# EAGLE design PDB - Copy (EAGLE 9.6.2)
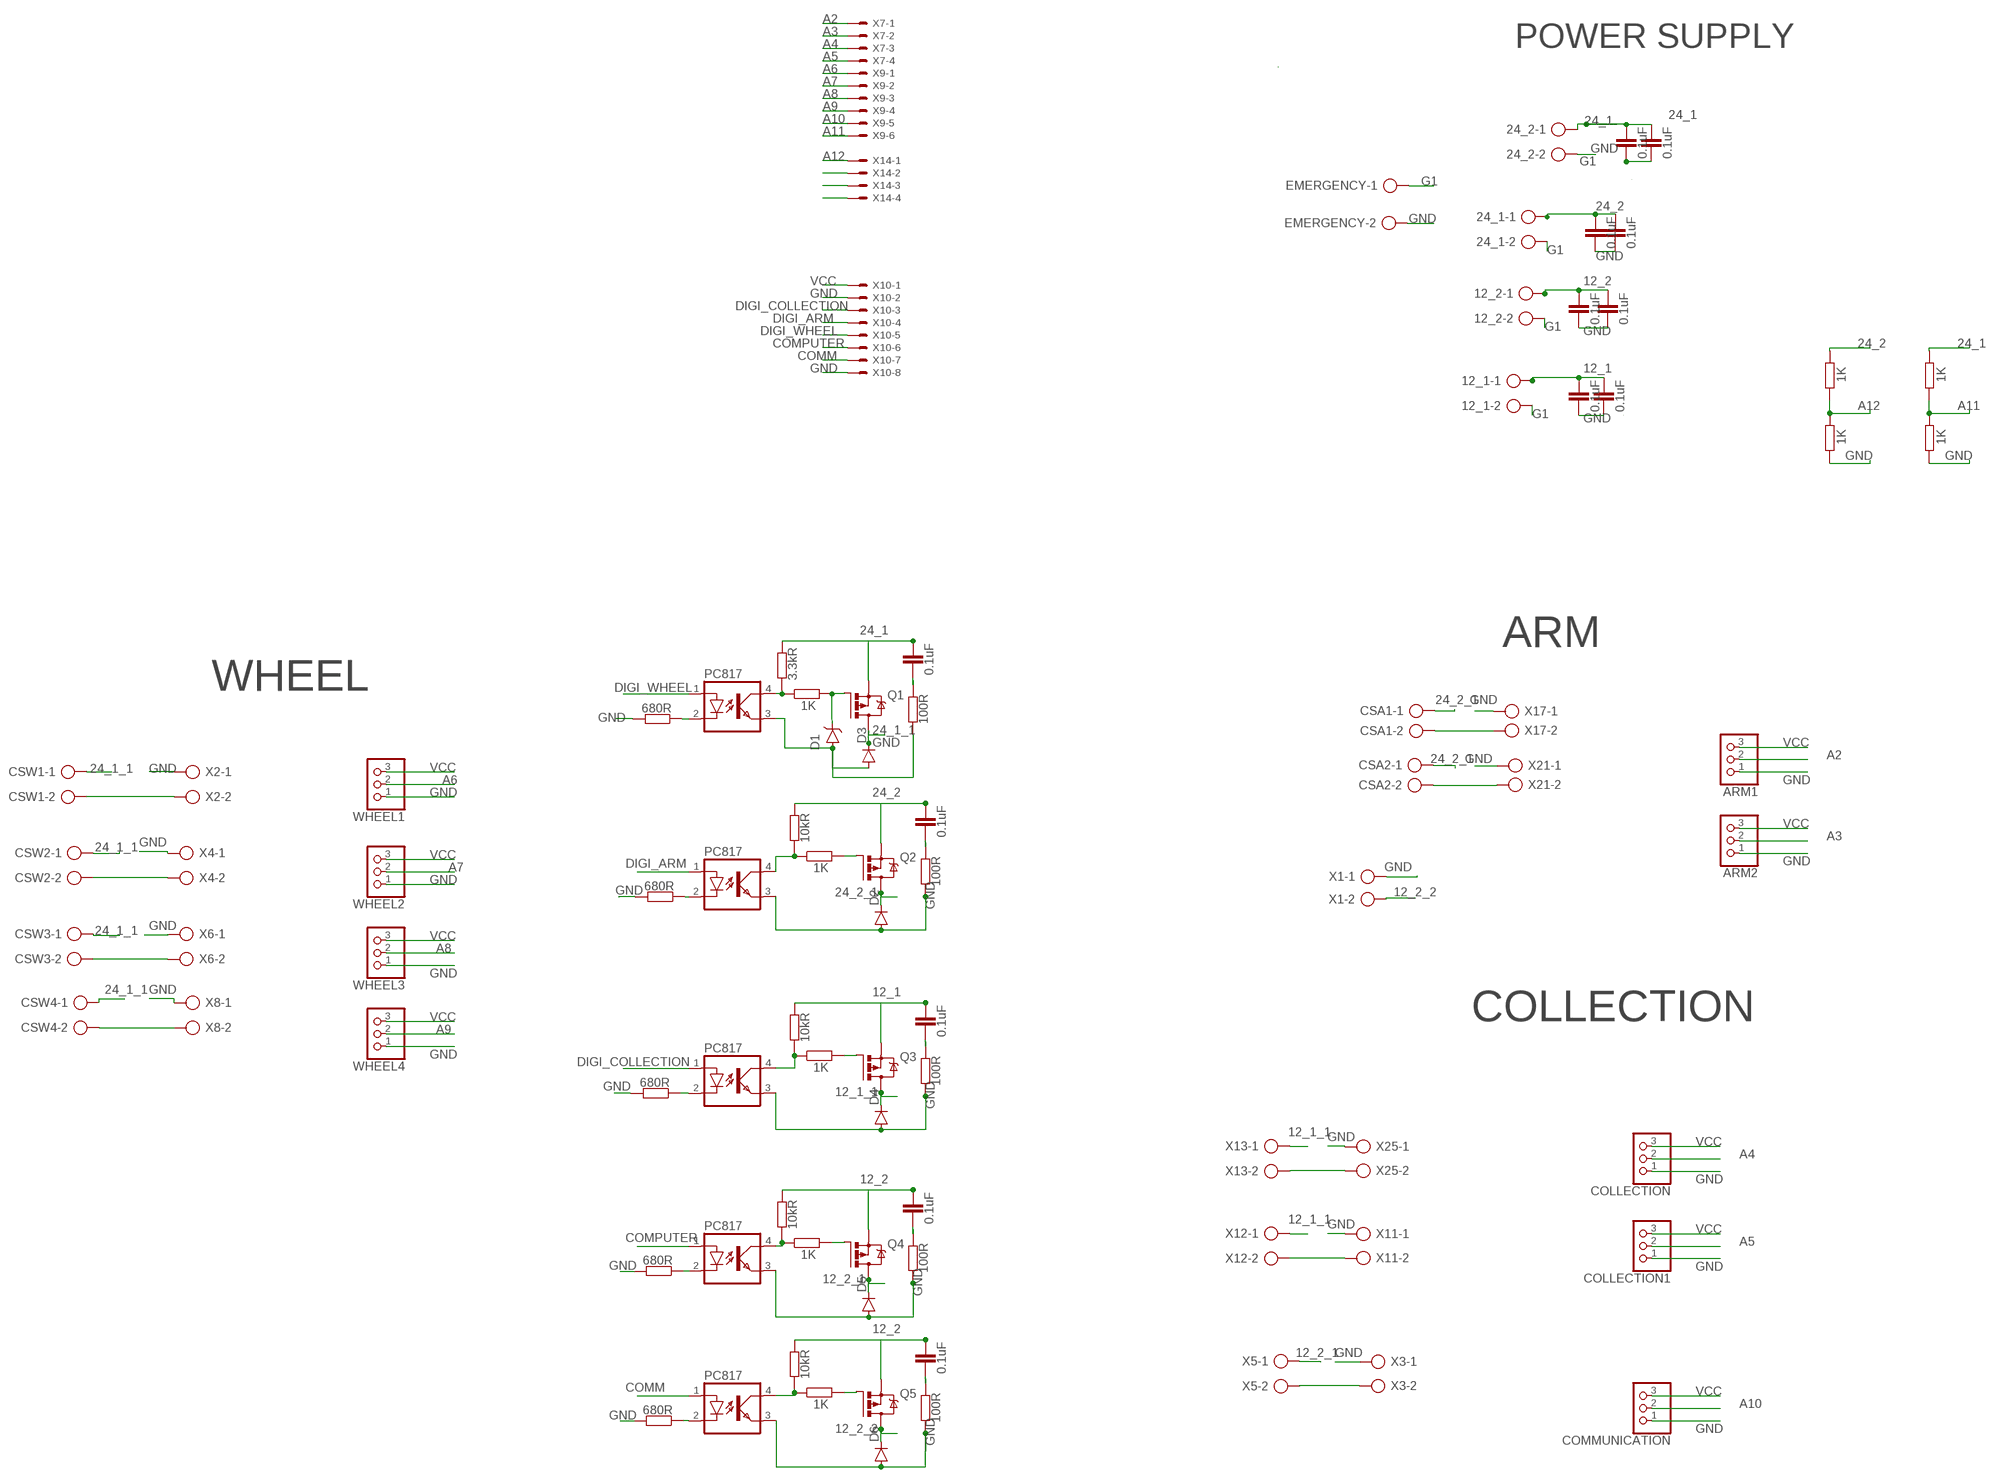
[diagram p0: schematic, sheet 1]

## Parts
12_1  AK300/2  [AK300/2]
12_2  AK300/2  [AK300/2]
24_1  AK300/2  [AK300/2]
24_2  AK300/2  [AK300/2]
ARM1  PINHD-1X3  [1X03]
ARM2  PINHD-1X3  [1X03]
C1  0.1uF  C-EUC1206  [C1206]
C2  0.1uF  C-EUC1206  [C1206]
C3  0.1uF  C-EUC1206  [C1206]
C4  0.1uF  C-EUC1206  [C1206]
C5  0.1uF  C-EUC1206  [C1206]
C6  0.1uF  C-EUC1206  [C1206]
C7  0.1uF  C-EUC1206  [C1206]
C8  0.1uF  C-EUC1206  [C1206]
C9  0.1uF  C-EUC1206  [C1206]
C10  0.1uF  C-EUC1206  [C1206]
C11  0.1uF  C-EUC1206  [C1206]
C18  0.1uF  C-EUC1206  [C1206]
C19  0.1uF  C-EUC1206  [C1206]
COLLECTION  PINHD-1X3  [1X03]
COLLECTION1  PINHD-1X3  [1X03]
COMMUNICATION  PINHD-1X3  [1X03]
CSA1  AK300/2  [AK300/2]
CSA2  AK300/2  [AK300/2]
CSW1  AK300/2  [AK300/2]
CSW2  AK300/2  [AK300/2]
CSW3  AK300/2  [AK300/2]
CSW4  AK300/2  [AK300/2]
D1  1N4740A-TR  [DO-41]
D2  1N4942  [DO41-10]
D3  1N4942  [DO41-10]
D4  1N4942  [DO41-10]
D5  1N4942  [DO41-10]
D6  1N4942  [DO41-10]
EMERGENCY  AK300/2  [AK300/2]
OK1  PC817  [DIL04]
OK2  PC817  [DIL04]
OK3  PC817  [DIL04]
OK4  PC817  [DIL04]
OK5  PC817  [DIL04]
Q1  PMOSFET-BACKUP_TO220  [TO220BV]
Q2  PMOSFET-BACKUP_TO220  [TO220BV]
Q3  PMOSFET-BACKUP_TO220  [TO220BV]
Q4  PMOSFET-BACKUP_TO220  [TO220BV]
Q5  PMOSFET-BACKUP_TO220  [TO220BV]
R1  680R  R-EU_R1206  [R1206]
R2  1K  R-EU_R1206  [R1206]
R3  3.3kR  R-EU_R1206  [R1206]
R4  100R  R-EU_R1206  [R1206]
R5  680R  R-EU_R1206  [R1206]
R6  100R  R-EU_R1206  [R1206]
R7  1K  R-EU_R1206  [R1206]
R8  10kR  R-EU_R1206  [R1206]
R9  680R  R-EU_R1206  [R1206]
R10  100R  R-EU_R1206  [R1206]
R11  1K  R-EU_R1206  [R1206]
R12  10kR  R-EU_R1206  [R1206]
R13  680R  R-EU_R1206  [R1206]
R14  100R  R-EU_R1206  [R1206]
R15  1K  R-EU_R1206  [R1206]
R16  10kR  R-EU_R1206  [R1206]
R17  1K  R-EU_R1206  [R1206]
R18  1K  R-EU_R1206  [R1206]
R19  1K  R-EU_R1206  [R1206]
R20  1K  R-EU_R1206  [R1206]
R21  100R  R-EU_R1206  [R1206]
R22  1K  R-EU_R1206  [R1206]
R23  10kR  R-EU_R1206  [R1206]
R24  680R  R-EU_R1206  [R1206]
WHEEL1  PINHD-1X3  [1X03]
WHEEL2  PINHD-1X3  [1X03]
WHEEL3  PINHD-1X3  [1X03]
WHEEL4  PINHD-1X3  [1X03]
X1  AK300/2  [AK300/2]
X2  AK300/2  [AK300/2]
X3  AK300/2  [AK300/2]
X4  AK300/2  [AK300/2]
X5  AK300/2  [AK300/2]
X6  AK300/2  [AK300/2]
X7  JST-XH-04-PIN-LONG-PAD  [JST-XH-04-PACKAGE-LONG-PAD]
X8  AK300/2  [AK300/2]
X9  JST-XH-06-PIN-LONG-PAD  [JST-XH-06-PACKAGE-LONG-PAD]
X10  JST-XH-08-PIN-LONG-PAD  [JST-XH-08-PACKAGE-LONG-PAD]
X11  AK300/2  [AK300/2]
X12  AK300/2  [AK300/2]
X13  AK300/2  [AK300/2]
X14  JST-XH-04-PIN-LONG-PAD  [JST-XH-04-PACKAGE-LONG-PAD]
X17  AK300/2  [AK300/2]
X21  AK300/2  [AK300/2]
X25  AK300/2  [AK300/2]

## Nets
12_1 [HV]: 12_1.1 C3.2 C9.2 C10.2 Q3.S R12.2
12_1_1 [HV]: D4.C Q3.D X12.1 X13.1
12_2 [HV]: 12_2.1 C4.2 C5.2 C6.2 C11.2 Q4.S Q5.S R16.2 R23.2
12_2_1 [HV]: D5.C Q4.D X5.1
12_2_2 [HV]: D6.C Q5.D X1.2
24_1 [HV]: 24_2.1 C1.2 C7.2 C8.2 Q1.S R3.2 R19.2
24_1_1 [HV]: CSW1.1 CSW2.1 CSW3.1 CSW4.1 D3.C Q1.D
24_2 [HV]: 24_1.1 C2.2 C18.2 C19.2 Q2.S R8.2 R17.2
24_2_1 [HV]: CSA1.1 CSA2.1 D2.C Q2.D
A2: ARM1.2 X7.1
A3: ARM2.2 X7.2
A4: COLLECTION.2 X7.3
A5: COLLECTION1.2 X7.4
A6: WHEEL1.2 X9.1
A7: WHEEL2.2 X9.2
A8: WHEEL3.2 X9.3
A9: WHEEL4.2 X9.4
A10: COMMUNICATION.2 X9.5
A11: R19.1 R20.2 X9.6
A12: R17.1 R18.2 X14.1
COMM: OK5.1(A) X10.7
COMPUTER: OK4.1(A) X10.6
DIGI_ARM: OK2.1(A) X10.4
DIGI_COLLECTION: OK3.1(A) X10.3
DIGI_WHEEL: OK1.1(A) X10.5
G1 [gnd]: 12_1.2 12_2.2 24_1.2 24_2.2 EMERGENCY.1
GND [gnd]: ARM1.1 ARM2.1 C5.1 C6.1 C7.1 C8.1 C9.1 C10.1 C18.1 C19.1 COLLECTION1.1 COLLECTION.1 COMMUNICATION.1 D1.A D2.A D3.A D4.A D5.A D6.A EMERGENCY.2 OK1.3(EMIT) OK2.3(EMIT) OK3.3(EMIT) OK4.3(EMIT) OK5.3(EMIT) R1.2 R4.1 R5.2 R6.1 R9.2 R10.1 R13.2 R14.1 R18.1 R20.1 R21.1 R24.2 WHEEL1.1 WHEEL2.1 WHEEL3.1 WHEEL4.1 X1.1 X2.1 X3.1 X4.1 X6.1 X8.1 X10.2 X10.8 X11.1 X17.1 X21.1 X25.1
N$1: OK1.4(COL) R2.1 R3.1
N$2: OK4.2(C) R13.1
N$3: OK3.2(C) R9.1
N$4: OK2.4(COL) R7.1 R8.1
N$5: C2.1 R6.2
N$6: OK3.4(COL) R11.1 R12.1
N$7: C4.1 R14.2
N$8: C3.1 R10.2
N$9: Q4.G R15.2
N$10: OK4.4(COL) R15.1 R16.1
N$11: C11.1 R21.2
N$12: OK5.4(COL) R22.1 R23.1
N$13: Q5.G R22.2
N$14: OK2.2(C) R5.1
N$15: OK1.2(C) R1.1
N$18: X11.2 X12.2
N$19: Q2.G R7.2
N$20: X14.2
N$21: OK5.2(C) R24.1
N$22: Q3.G R11.2
N$23: X14.3
N$24: X14.4
N$29: CSW1.2 X2.2
N$32: CSW2.2 X4.2
N$33: C1.1 R4.2
N$35: D1.C Q1.G R2.2
N$36: CSW3.2 X6.2
N$40: CSW4.2 X8.2
N$51: CSA1.2 X17.2
N$53: CSA2.2 X21.2
N$57: X13.2 X25.2
N$67: X3.2 X5.2
VCC [vcc]: ARM1.3 ARM2.3 COLLECTION1.3 COLLECTION.3 COMMUNICATION.3 WHEEL1.3 WHEEL2.3 WHEEL3.3 WHEEL4.3 X10.1

## Notes on the sheet
- POWER SUPPLY
- ARM
- WHEEL
- COLLECTION

## Library data of the parts
12_1 12_2 24_1 24_2 CSA1 CSA2 CSW1-CSW4 EMERGENCY X1-X6 X8 X11-X13 X17 X21 X25 = con-ptr500:AK300/2: CONNECTOR; OC_FARNELL: unknown; OC_NEWARK: unknown
ARM1 ARM2 COLLECTION COLLECTION1 COMMUNICATION WHEEL1-WHEEL4 = adafruit:PINHD-1X3: PIN HEADER
C1-C11 C18 C19 = rcl:C-EU: CAPACITOR, European symbol; SPICEPREFIX: C
D1 = Diodes-2:1N4740A-TR: DIODE ZENER 10V 1.3W DO41 Manufacturer's datasheet <https://www.vishay.com/docs/85816/1n4728a.pdf>; CREATED_BY: PCBLayout.com; DIGIKEY_PART_NUMBER: 1N4740AVSCT-ND; MANUFACTURER: Vishay General Semiconductor - Diodes Division; MPN: 1N4740A-TR; PACKAGE: DO-41
D2-D6 = diode:1N4942: DIODE 1.0 A, 200 V, 150 ns
OK1-OK5 = optocoupler:PC817: SHARP OPTO COUPLER; MPN: PC817X4J000F; OC_FARNELL: 9707727; OC_NEWARK: 97K7059
Q1-Q5 = Tinkercad:PMOSFET-BACKUP: P-Channel MOSFET - Generic
R1-R24 = rcl:R-EU_: RESISTOR, European symbol; SPICEPREFIX: R
X7 X14 = JST:JST-XH-04-PIN: JST XH Connector 2 Pin Wire to board connector. Pitch: 2,54 mm, (0.100") Number of pins: 4 Created by Rembrandt Electronics www.rembrandtelectronics.com
X9 = JST:JST-XH-06-PIN: JST XH Connector 2 Pin Wire to board connector. Pitch: 2,54 mm, (0.100") Number of pins: 6 Created by Rembrandt Electronics www.rembrandtelectronics.com
X10 = JST:JST-XH-08-PIN: JST XH Connector 2 Pin Wire to board connector. Pitch: 2,54 mm, (0.100") Number of pins: 8 Created by Rembrandt Electronics www.rembrandtelectronics.com

## Net classes
0 default: width 0.8 mm, drill 0.889 mm, clearance 0.381 mm
1 HV: width 2 mm, drill 0.889 mm, clearance 0.381 mm
2 gnd: width 1 mm, drill 0.889 mm, clearance 0.381 mm
3 vcc: width 0.7 mm, drill 0.889 mm, clearance 0.381 mm

## Board
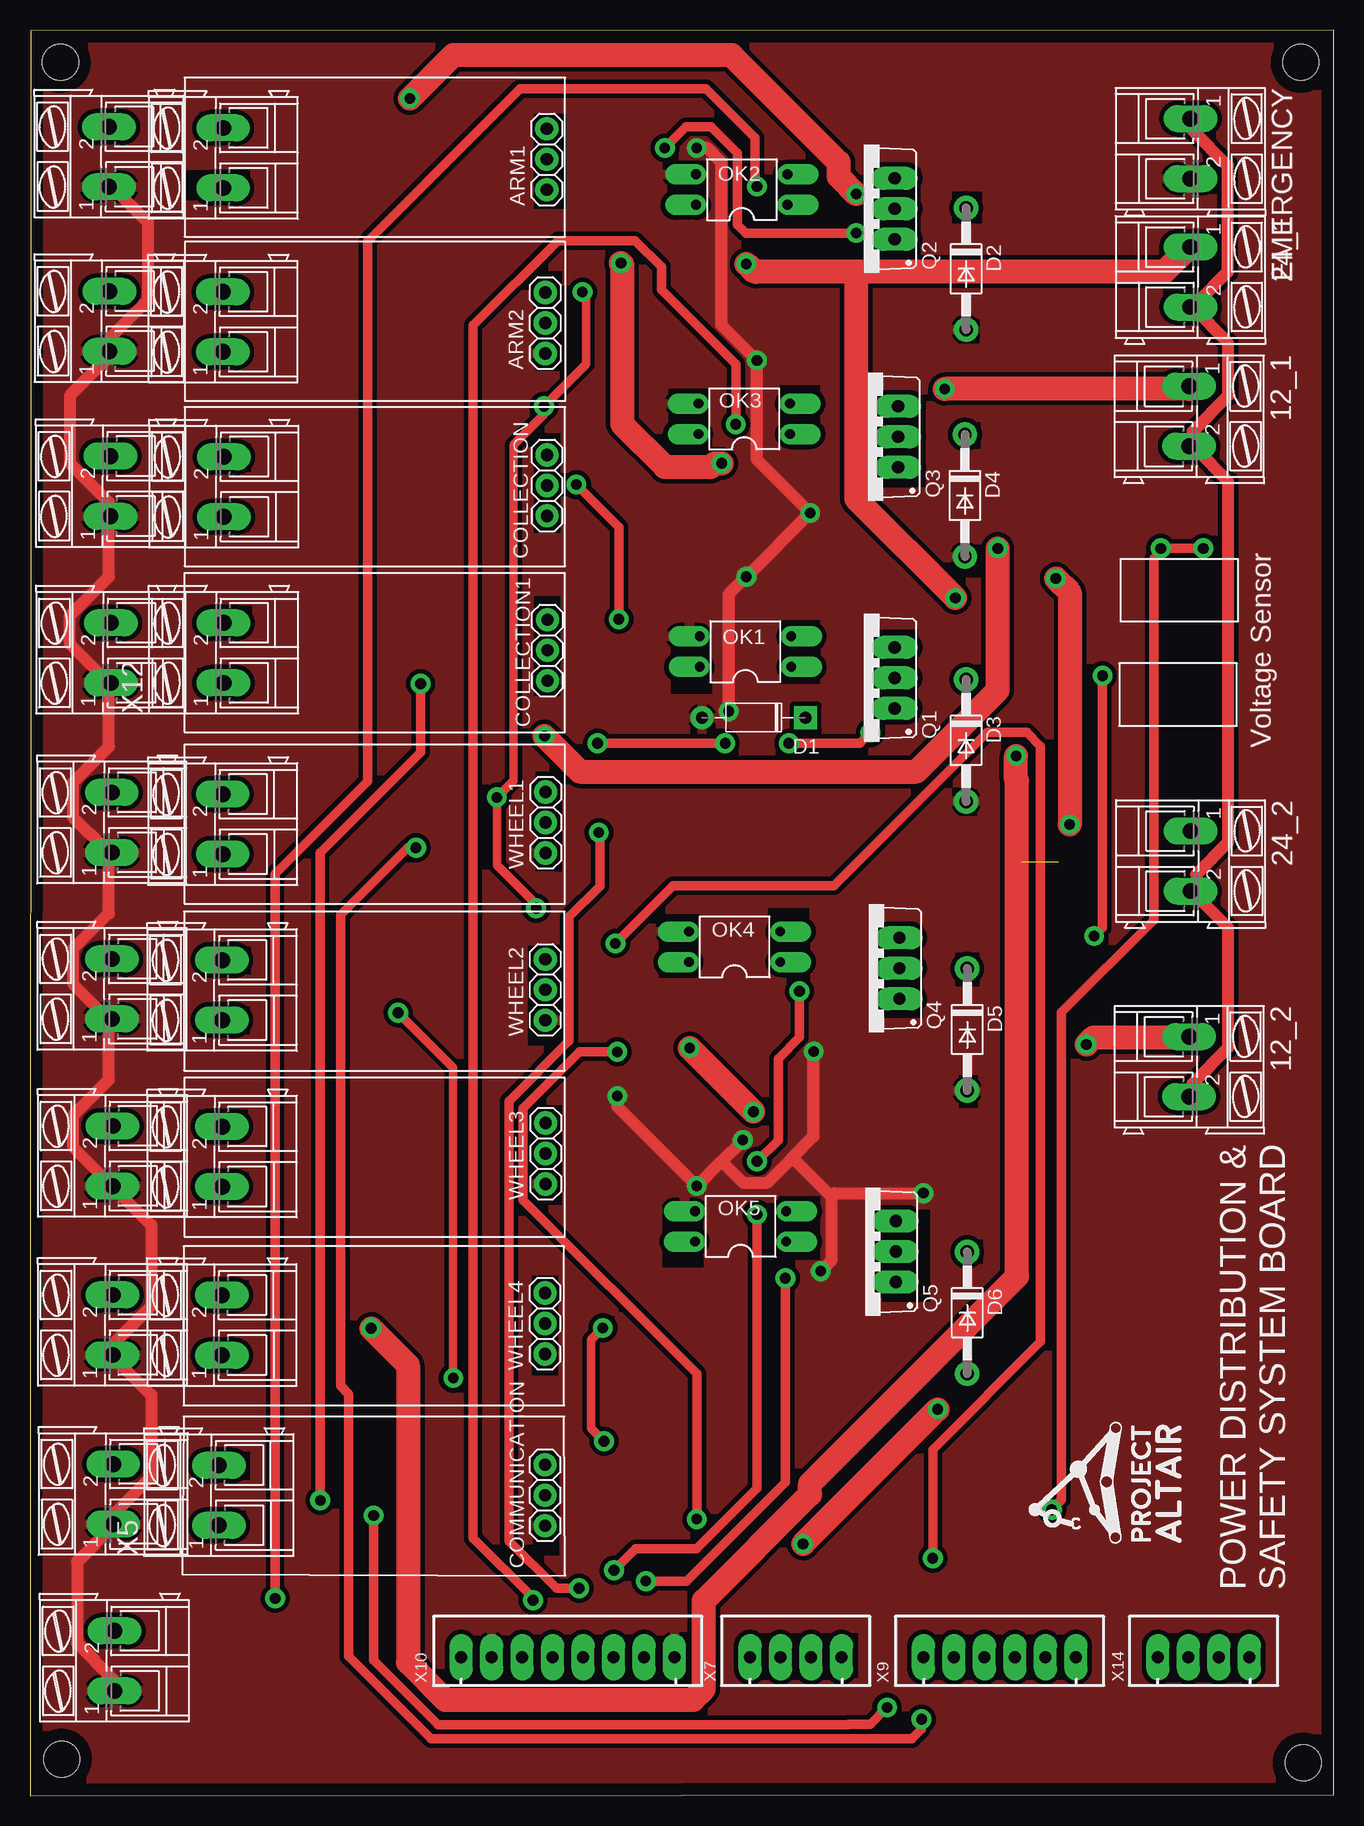
[diagram p1: board, top side]
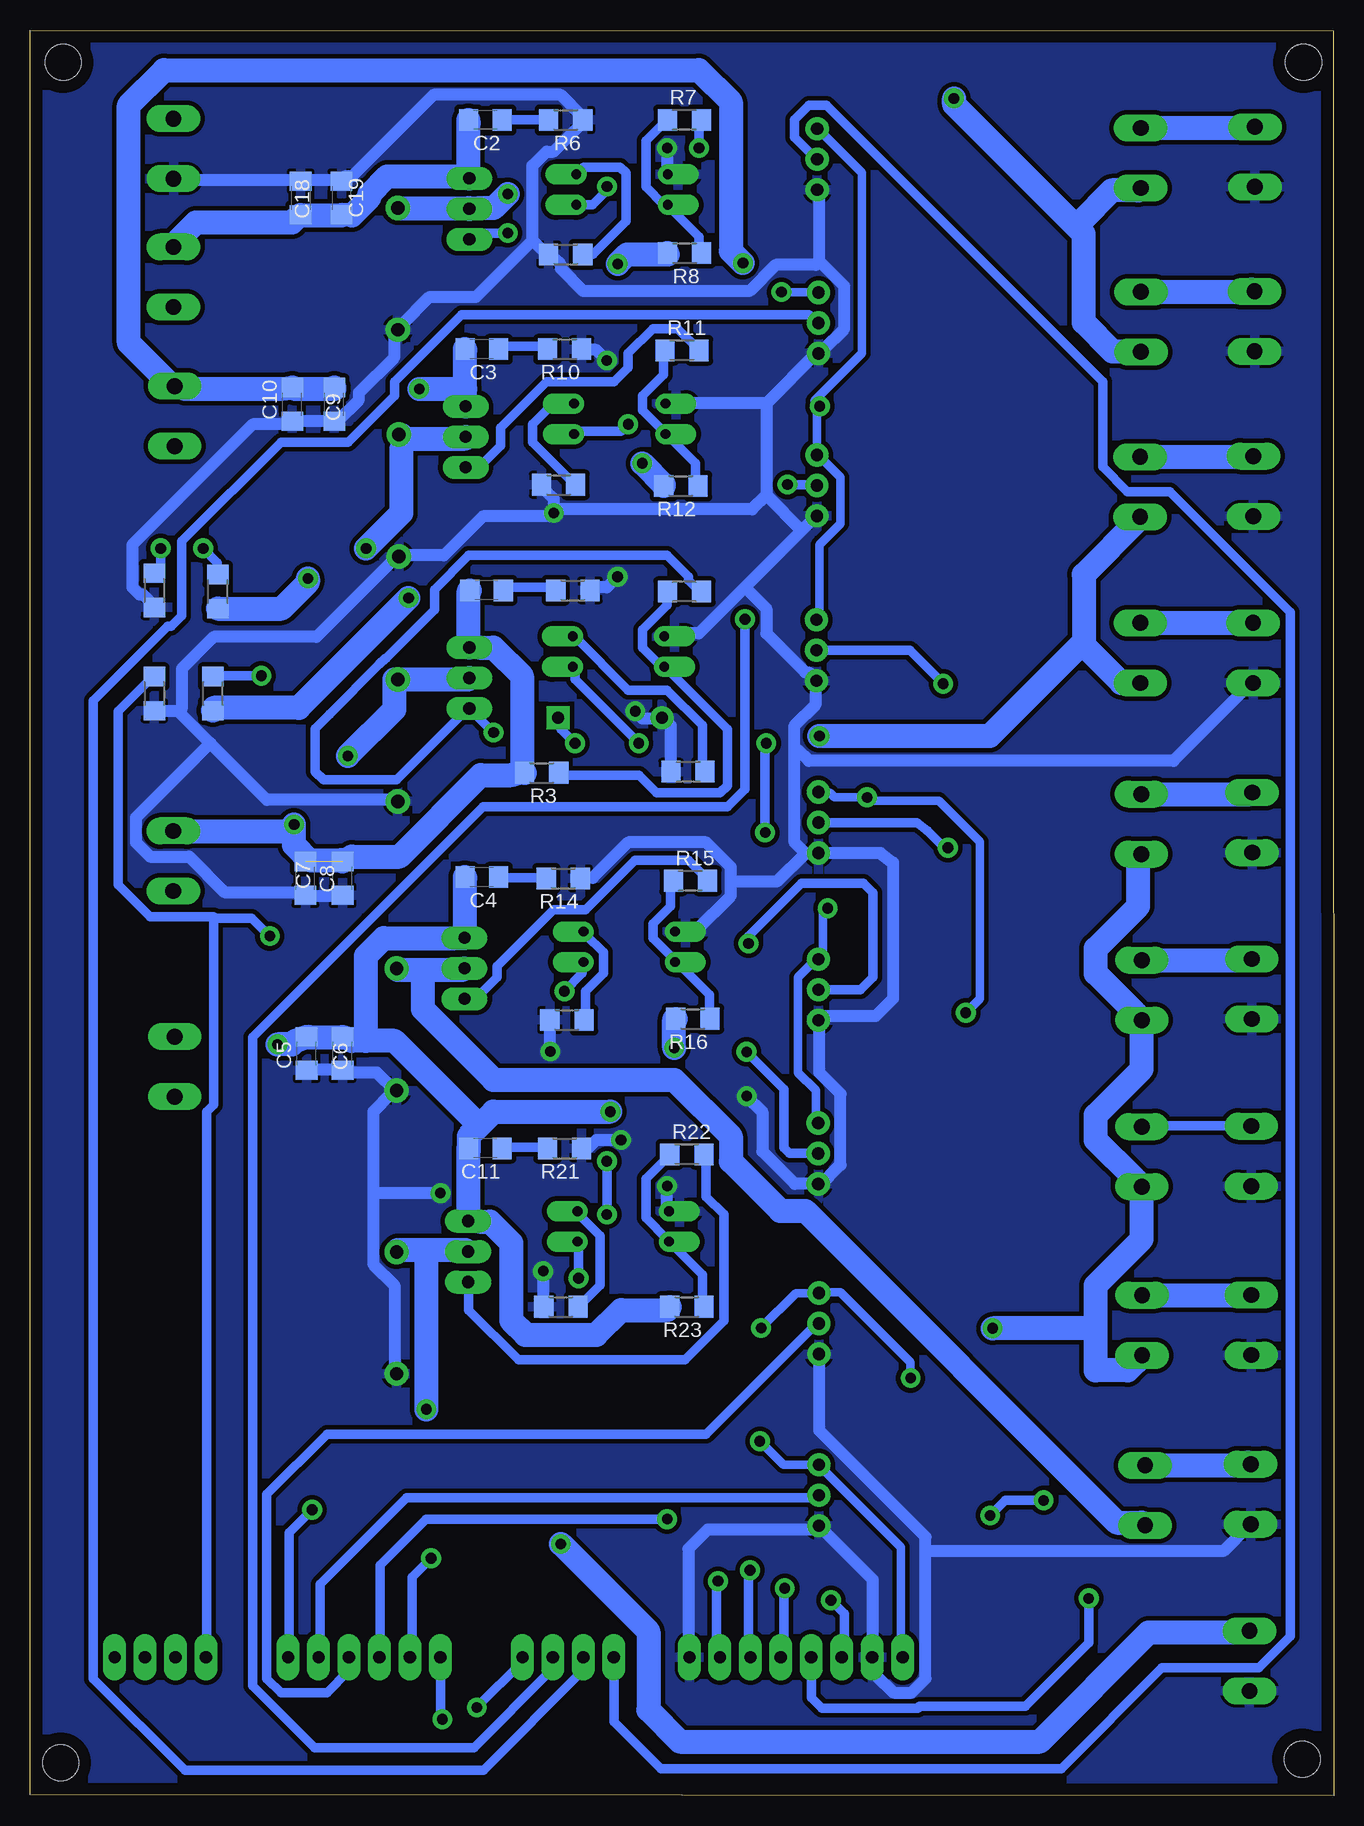
[diagram p2: board, bottom side, seen from below]

Size 108.7 x 147.14 mm. Coordinates in mm from the lower left corner, seen from the top.
Outline: 0,0 108.7,0.07 108.67,147.14 0.07,147.07 0,0
Copper layers (1*16): Top 0.035mm / dielectric 1.5mm / Bottom 0.035mm
Design rules "default *": minimum track width 0.7mm, minimum drill 0.65mm, track to track 15mil, track to pad 15mil, pad to pad 6mil, via to via 15mil, smd to smd 6mil, copper to edge 40mil, drill to drill 6mil, minimum pad ring 18mil, minimum via ring 15mil, stop-mask expansion 4mil, vias tented up to drill 0mil, thermal gap 10mil
Holes 3 mm at 2.54,144.45 105.94,144.45 106.14,2.75 2.64,3.05
tRestrict: area 42,132.2 to 44.7,140.1; area 53.3,131.5 to 56.5,136.2; area 70.4,128.2 to 74.2,135.6; area 62.4,131.6 to 65.7,136.2; area 76.8,131 to 79.3,133.6; area 77.3,121 to 79.1,123; area 77.1,112.2 to 79.2,114.4; area 76.9,101.5 to 79.4,104.1; area 70.6,109 to 74.6,116.7; area 62.5,112.5 to 65.8,117.5; area 53.2,111.9 to 56.6,117.2; area 42.1,118.7 to 44.3,127; 46 more areas

### Footprints (pad centres in the part's own frame; a part is rotated, then mirrored left to right if it is on the bottom)
AK300/2 = drill 1.321 long: 1 -2.515,0; 2 2.489,0
1X03 = drill 1.016: 1 -2.54,0; 2 0,0; 3 2.54,0
C1206 = smd 1.6 x 1.8: 1 -1.4,0; 2 1.4,0
DO-41 = drill 1: A 4.325,0 | drill 1 square: C -4.325,0
DO41-10 = drill 1.118: A 5.08,0; C -5.08,0
DIL04 = drill 0.813 offset: 1 -1.27,-3.81; 2 1.27,-3.81; 3 1.27,3.81; 4 -1.27,3.81
TO220BV = drill 1.016 long: D 0,-2.54; G -2.54,-2.54; S 2.54,-2.54
R1206 = smd 1.6 x 1.803: 1 -1.422,0; 2 1.422,0
JST-XH-04-PACKAGE-LONG-PAD = drill 1.016 long: 1 -3.81,0; 2 -1.27,0; 3 1.27,0; 4 3.81,0
JST-XH-06-PACKAGE-LONG-PAD = drill 1.016 long: 1 -6.35,0; 2 -3.81,0; 3 -1.27,0; 4 1.27,0; 5 3.81,0; 6 6.35,0
JST-XH-08-PACKAGE-LONG-PAD = drill 1.016 long: 1 -8.89,0; 2 -6.35,0; 3 -3.81,0; 4 -1.27,0; 5 1.27,0; 6 3.81,0; 7 6.35,0; 8 8.89,0

### Placement (x,y rotation side)
12_1  96.64,114.95 270 top
12_2  96.64,60.75 270 top
24_1  96.74,126.55 270 top
24_2  96.75,77.88 270 top
ARM1  43.08,136.37 90 top
ARM2  42.96,122.73 90 top
C1  70.64,100.45 180 bottom
C2  70.74,139.65 180 bottom
C3  71.04,120.55 180 bottom
C4  71.04,76.55 180 bottom
C5  85.64,61.85 90 bottom
C6  82.64,61.85 90 bottom
C7  85.74,76.45 90 bottom
C8  82.64,76.45 90 bottom
C9  83.34,115.95 90 bottom
C10  86.84,115.95 90 bottom
C11  70.74,53.95 180 bottom
C18  86.14,133.15 270 bottom
C19  82.74,133.15 270 bottom
COLLECTION  43.1,109.19 90 top
COLLECTION1  43.14,95.45 90 top
COMMUNICATION  42.94,25.05 90 top
CSA1  16.11,136.49 90 top
CSA2  16.08,122.83 90 top
CSW1  16.06,80.97 90 top
CSW2  16.01,67.14 90 top
CSW3  16.01,53.27 90 top
CSW4  15.99,39.22 90 top
D1  60.34,89.85 180 top
D2  78.04,127.25 270 top
D3  78.04,87.95 270 top
D4  77.94,108.35 270 top
D5  78.14,63.85 270 top
D6  78.14,40.25 270 top
EMERGENCY  96.74,137.25 270 top
OK1  59.64,95.35 90 top
OK2  59.34,133.85 90 top
OK3  59.54,114.75 90 top
OK4  58.74,70.75 90 top
OK5  59.24,47.45 90 top
Q1  69.54,93.15 90 top
Q2  69.54,132.25 90 top
Q3  69.84,113.25 90 top
Q4  69.94,68.95 90 top
Q5  69.64,45.35 90 top
R1  53.84,85.35 180 bottom
R2  54.14,100.35 0 bottom
R3  66.04,85.25 180 bottom
R4  63.44,100.45 180 bottom
R5  64.04,128.45 180 bottom
R6  64.04,139.65 180 bottom
R7  54.14,139.65 0 bottom
R8  54.14,128.55 180 bottom
R9  64.64,109.25 180 bottom
R10  64.14,120.55 180 bottom
R11  54.34,120.45 0 bottom
R12  54.44,109.15 180 bottom
R13  63.94,64.65 180 bottom
R14  64.24,76.45 180 bottom
R15  53.64,76.25 0 bottom
R16  53.44,64.75 180 bottom
R17  93.44,91.85 270 bottom
R18  98.34,91.85 90 bottom
R19  93.04,100.35 270 bottom
R20  98.34,100.45 90 bottom
R21  64.14,53.95 180 bottom
R22  53.94,53.45 0 bottom
R23  53.94,40.75 180 bottom
R24  64.44,40.75 180 bottom
U$2  [ALTAIR]  96.94,20.15 90 top
WHEEL1  42.98,81.1 90 top
WHEEL2  42.96,67.17 90 top
WHEEL3  42.99,53.52 90 top
WHEEL4  42.94,39.35 90 top
X1  7.04,11.25 90 top
X2  6.82,81.11 90 top
X3  6.94,25.15 90 top
X4  6.84,67.24 90 top
X5  15.74,25.05 90 top
X6  6.89,53.32 90 top
X7  63.84,11.55 0 top
X8  6.89,39.24 90 top
X9  80.84,11.55 0 top
X10  44.84,11.55 0 top
X11  6.74,95.25 90 top
X12  16.14,95.25 90 top
X13  16.15,109.09 90 top
X14  97.84,11.55 0 top
X17  6.58,136.59 90 top
X21  6.61,122.88 90 top
X25  6.71,109.14 90 top

### Tracks (layer width: path | path; a pad name or v marks a point on that pad's centre or on a via)
12_1  (via drill 0.89)
  Top 2: v57.65,111.03 57.06,111.03 56.77,110.74 52.93,110.74 49.37,114.3 49.37,127.62 v49.27,127.72 | v76.25,117.23 96.63,117.23 12_1.1
  Bottom 2: 72.42,117.23 72.42,116.05 Q3.S | 72.42,117.23 72.42,120.48 C3.2 | C9.2 83.34,117.23 86.59,117.23 C10.2 87.77,117.23 95.74,117.23 12_1.1 96.92,117.53 100.46,121.07 100.46,140.85 97.51,143.81 52.93,143.81 50.27,141.15 50.27,128.72 v49.27,127.72 | v57.65,111.03 55.88,109.26 R12.2 | v76.25,117.23 72.42,117.23
12_1_1  (via drill 0.89)
  Top 2: v80.68,103.95 80.68,92.14 73.89,85.35 45.84,85.35 v42.89,88.3
  Bottom 2: 77.44,113.1 72.42,113.1 Q3.D | 77.44,113.1 77.73,113.4 D4.C | X12.1 17.73,92.73 20.86,95.87 20.86,96.16 | 20.86,96.16 20.86,101.77 16.32,106.31 X13.1 | v80.68,103.95 77.73,106.9 77.73,112.22 77.44,113.1 | v42.89,88.3 28.72,88.3 20.86,96.16
12_2  (via drill 0.89)
  Top 2: v60.31,57 v55,62.32 | v88.06,62.61 88.65,63.2 96.63,63.2 12_2.1
  Bottom 2: C4.2 72.42,76.49 72.42,71.77 Q4.S 73.3,71.47 79.21,71.47 80.68,69.99 80.68,62.91 | R23.2 55.59,40.47 59.43,40.47 61.49,38.4 67.4,38.4 68.58,39.58 68.58,46.08 70.35,47.85 71.24,47.85 Q5.S 72.12,48.15 72.12,53.76 C11.2 72.12,54.94 71.24,55.82 | v55,62.32 55,64.68 R16.2 | v60.31,57 70.05,57 71.24,55.82 | 80.68,62.91 78.32,62.91 71.24,55.82 | 80.68,62.91 81.86,62.91 C6.2 82.75,63.2 85.41,63.2 C5.2 86.59,62.91 86.88,62.61 v88.06,62.61
12_2_1
  Bottom 2: 75.96,68.81 78.03,68.81 D5.C | 75.96,68.81 72.71,68.81 Q4.D | 75.96,68.81 75.96,65.57 70.05,59.66 55,59.66 50.27,54.94 50.27,52.87 46.14,48.74 44.07,48.74 18.09,22.75 16.02,22.75 X5.1
12_2_2  (via drill 0.89)
  Top 2: v75.66,32.2 v64.44,20.98
  Bottom 2: 75.66,45.49 78.03,45.49 D6.C | 75.66,45.49 72.42,45.49 Q5.D | v64.44,20.98 57.15,13.69 57.15,7.14 54.52,4.52 24.53,4.52 15.44,13.6 7.17,13.6 X1.2 | 75.66,45.49 v75.66,32.2
24_1  (via drill 0.89)  (1 unrouted)
  Top 2: v85.52,101.43 86.68,100.28 v86.68,80.93
  Bottom 2: C1.2 72.12,100.41 72.12,95.98 Q1.S 71.24,95.68 70.05,95.68 67.69,93.32 67.69,85.35 | 67.69,85.35 R3.2 | R19.2 87.74,98.92 85.52,101.14 v85.52,101.43 | 24_2.1 96.63,80.33 87.28,80.33 v86.68,80.93 86.68,79.23 85.41,77.97 82.75,77.97 C8.2 81.86,78.26 77.91,78.26 71.12,85.05 68.58,85.05 67.69,85.35
24_1_1  (via drill 0.89)
  Top 2: v82.2,86.65 82.2,84.65 82.28,84.57 82.28,43.25 65.03,26 65.03,25.12 56.18,16.26 56.18,8.88 55.29,7.99 34.62,7.99 31.51,11.1 31.51,35.88 v28.44,38.95
  Bottom 2: v82.2,86.65 78.32,90.53 78.32,93.02 D3.C 72.2,93.03 Q1.D | 19.86,38.95 v28.44,38.95 | CSW4.1 16.02,36.63 17.2,35.45 19.86,35.45 19.86,38.95 | 19.86,38.95 19.86,42.54 16.02,46.37 16.02,50.51 CSW3.1 16.61,51.39 19.86,54.64 19.86,56.71 16.02,60.55 16.02,64.38 CSW2.1 16.61,65.27 19.86,68.52 19.86,70.59 16.32,74.13 16.32,78.26 CSW1.1
24_2  (via drill 0.89)
  Top 2: v59.71,127.65 60.31,127.05 60.48,127.05 60.55,126.98 68.87,126.98 | 68.87,126.98 94.56,126.98 96.63,129.04 24_1.1 | v77.14,99.81 68.87,108.08 68.87,126.98
  Bottom 2: C2.2 72.12,139.38 72.12,134.95 Q2.S 73.01,134.95 78.91,134.95 80.39,133.47 80.39,133.18 81.86,131.7 C19.2 82.75,131.7 86,131.7 C18.2 86.88,131.11 94.86,131.11 96.63,129.34 24_1.1 | v59.71,127.65 58.91,128.45 55.52,128.45 55.56,128.47 R8.2 | v77.14,99.81 86.29,90.66 93.38,90.66 R17.2
24_2_1  (via drill 0.89)
  Top 2: v68.87,133.47 67.4,134.95 67.4,136.13 58.48,145.04 35.27,145.04 v31.67,141.44
  Bottom 2: D2.C 78.03,132.29 72.12,132.29 Q2.D 71.24,132.29 70.05,132.29 v68.87,133.47 | CSA1.1 16.32,133.77 18.52,133.77 21.19,131.1 21.19,130.46 | v31.67,141.44 31.67,140.94 21.19,130.46 | CSA2.1 16.11,120.35 18.44,120.35 20.86,122.77 20.86,130.13 21.19,130.46
A2
  Bottom 0.8: ARM1.2 43.19,136.43 44.96,138.2 44.96,139.67 43.78,140.85 42.3,140.85 19.27,117.82 19.27,110.74 17.2,108.67 13.66,108.67 3.62,98.63 3.62,13.31 6.28,10.65 14.34,10.65 22.74,2.25 56.12,2.25 60.02,6.15 60.02,11.53 X7.1
A3
  Bottom 0.8: X7.2 62.67,11.53 62.67,10.35 70.91,2.12 95.77,2.12 103.42,9.76 103.42,91.25 97.22,97.45 96.92,97.45 96.04,98.34 96.04,104.54 87.77,112.81 82.16,112.81 78.32,116.64 78.32,117.82 72.71,123.43 43.78,123.43 43.19,122.84 ARM2.2
A4  (via drill 0.89)
  Top 0.8: v49.09,98.04 49.09,105.72 v45.55,109.26
  Bottom 0.8: v49.09,98.04 49.09,83.87 50.57,82.4 70.94,82.4 90.13,63.2 90.13,9.17 84.96,4 71.68,4 65.33,10.35 65.33,11.53 X7.3 | v45.55,109.26 43.19,109.26 COLLECTION.2
A5  (via drill 0.89)
  Top 0.8: v71.45,7.35 70.05,5.95 68.25,5.95 68.22,5.93 34.03,5.93 28.65,11.31 v28.65,23.35 | v24.19,24.61 24.19,78.59 32.57,86.96 v32.57,92.66
  Bottom 0.8: v71.45,7.35 67.65,11.16 X7.4 | v24.19,24.61 27.39,24.61 v28.65,23.35 | v32.57,92.66 35.35,95.45 COLLECTION1.2
A6  (via drill 0.89)
  Top 0.8: v74.32,6.37 74.32,5.56 73.51,4.74 33.44,4.74 26.57,11.62 26.57,33.47 25.88,34.16 25.88,73.4 31.48,79 v32.18,79
  Bottom 0.8: X9.1 74.49,6.54 v74.32,6.37 | v32.18,79 32.48,79 33.89,80.42 34.78,81.1 WHEEL1.2
A7  (via drill 0.89)
  Top 0.8: v75.26,19.79 75.26,28.85 84.25,37.84 84.25,87.46 83.09,88.62 79.82,88.62 67.03,75.82 53.6,75.82 v48.8,71.02
  Bottom 0.8: v75.26,19.79 76.84,18.21 76.84,11.83 X9.2 | v48.8,71.02 48.8,71.62 44.4,76.02 39.2,76.02 38.43,75.25 38.43,68.2 39.47,67.17 WHEEL2.2
A8  (via drill 0.89)
  Top 0.8: v55.59,23.05 55.59,35.16 41.12,49.62 41.12,57.3 45.81,61.98 v48.96,61.98
  Bottom 0.8: v55.59,23.05 75.66,23.05 79.5,19.21 79.5,11.83 X9.3 | v48.96,61.98 45.86,58.88 45.86,53.99 45.39,53.52 WHEEL3.2
A9
  Bottom 0.8: X9.4 82.16,11.53 82.16,10.35 83.93,8.58 87.77,8.58 88.95,9.76 88.95,25.12 83.93,30.14 52.34,30.14 43.19,39.29 WHEEL4.2
A10
  Bottom 0.8: COMMUNICATION.2 43.19,24.82 77.32,24.82 84.52,17.62 84.52,11.83 X9.5
A11  (via drill 0.89)
  Top 0.8: v97.81,103.95 v94.26,103.95 94.26,103.65 93.67,103.06 93.67,72.95 86,65.27 86,24.64 v85.18,23.83
  Bottom 0.8: v94.26,103.95 93.08,102.77 93.08,101.88 R19.1 | v97.81,103.95 97.81,102.18 98.1,101.88 R20.2 | v85.18,23.83 87.08,21.93 87.08,11.66 X9.6
A12  (via drill 0.89)
  Top 0.8: v89.41,93.32 89.41,72.35 v88.7,71.64
  Bottom 0.8: R17.1 93.38,93.32 v89.41,93.32 | 93.38,73.14 90.2,73.14 v88.7,71.64 | R18.2 98.4,93.32 101.35,90.37 101.35,75.9 98.69,73.24 93.38,73.24 93.38,73.14 | 93.38,73.14 93.38,57.59 93.97,57 93.97,11.83 X14.1
COMM  (via drill 0.89)
  Top 0.8: v62.97,43.13 62.97,26.11 54.74,17.88 v51.34,17.88
  Bottom 0.8: v62.97,43.13 62.97,46.08 OK5.1 | v51.34,17.88 51.45,17.77 51.45,11.83 X10.7
COMPUTER  (via drill 0.89)
  Top 0.8: v64.15,67.04 64.15,63.2 62.38,61.43 62.38,54.64 v60.61,52.87 | v60.61,48.44 60.61,25.61 55.58,20.58 50.48,20.58 v48.68,18.78
  Bottom 0.8: v64.15,67.04 62.67,68.52 62.67,69.4 OK4.1 | v60.61,48.44 v60.61,52.87 | v48.68,18.78 48.8,18.67 48.8,11.83 X10.6
DIGI_ARM  (via drill 0.89)
  Top 0.8: v60.6,134.11 60.44,134.27 60.44,138.16 56.36,142.25 40.84,142.25 28.14,129.55 28.14,84.55 20.44,76.85 v20.44,16.45
  Bottom 0.8: OK2.1 61.81,132.58 60.6,133.79 v60.6,134.11 | X10.4 43.57,8.18 42.69,7.3 34.68,7.3 34.54,7.45 25.74,7.45 20.44,12.75 v20.44,16.45
DIGI_COLLECTION  (via drill 0.89)
  Top 0.8: v58.83,114.28 58.83,119.3 52.63,125.5 52.63,127.41 50.46,129.58 44.02,129.58 36.96,122.52 36.96,21.46 41.93,16.48 v41.93,16.28
  Bottom 0.8: v58.83,114.28 59.43,113.69 63.26,113.69 OK3.1 | v41.93,16.28 40.82,15.17 40.82,11.83 X10.3
DIGI_WHEEL  (via drill 0.89)
  Top 0.8: v47.32,87.71 v57.95,87.71 | v47.42,80.27 47.52,80.27 47.52,75.8 44.96,73.24 44.96,62.91 39.94,57.89 39.94,21.22 43.88,17.28 v45.78,17.28
  Bottom 0.8: v57.95,87.71 63.26,93.02 63.26,93.91 OK1.1 | v47.32,87.71 47.42,87.61 v47.42,80.27 | v45.78,17.28 45.84,17.22 45.84,11.83 X10.5
G1
  Top 1: 12_2.2 96.92,58.48 96.92,59.37 99.87,62.32 99.87,72.36 96.92,75.31 24_2.2 97.22,75.6 97.22,76.79 99.87,79.44 99.87,109.56 97.22,112.22 12_1.2 96.92,112.51 96.92,113.69 99.87,116.64 99.87,121.07 96.92,124.03 24_1.2 97.22,124.32 99.87,126.98 99.87,135.84 96.92,138.79 96.92,139.67 EMERGENCY.1
GND  (via drill 0.89)
  Top 1: v55.59,137.31 56.47,137.31 57.64,136.14 57.64,122.56 v60.61,119.6 60.61,111.33 v65.03,106.9 v59.72,101.59 58.24,100.11 v58.24,90.37 | 57.65,52.87 v55.59,50.8 48.95,57.44 v48.95,58.3 | 57.65,52.87 v59.43,54.64 | v65.33,62.02 65.33,54.94 63.56,53.17 | 63.56,53.17 61.49,51.1 59.43,51.1 57.65,52.87 | v65.92,43.72 66.81,44.6 66.81,49.92 | 63.56,53.17 66.81,49.92 | v74.48,50.21 67.1,50.21 66.81,49.92 | X17.1 6.87,134.06 9.82,131.11 9.82,124.62 6.87,121.66 6.87,120.48 X21.1 6.58,119.89 3.33,116.64 3.33,111.03 6.58,107.79 6.58,106.9 X25.1 6.58,106.31 6.58,101.59 3.33,98.34 3.33,95.98 6.28,93.02 X11.1 6.58,92.73 6.58,87.41 3.62,84.46 3.62,81.51 6.28,78.85 X2.1 6.58,78.56 6.58,73.54 3.62,70.59 3.62,67.63 6.28,64.98 X4.1 6.58,64.68 6.58,59.66 3.62,56.71 3.62,54.05 6.58,51.1 X6.1 7.17,50.51 10.12,47.56 10.12,40.76 7.17,37.81 7.17,36.93 X8.1 7.17,36.34 10.12,33.38 10.12,26.59 7.17,23.64 7.17,23.05 X3.1 6.87,22.46 3.92,19.51 3.92,12.72 6.87,9.76 6.87,8.88 X1.1
  Bottom 1: C8.1 82.75,75.01 85.7,75.01 C7.1 86,75.31 92.49,75.31 95.45,78.26 98.69,78.26 99.87,79.44 99.87,81.51 93.67,87.71 | 96.33,90.37 98.1,90.37 R18.1 | 93.67,87.71 88.95,82.99 78.16,82.99 D3.A | 93.67,87.71 96.33,90.37 | R1.2 55.29,85.35 55.29,89.19 55.88,89.78 D1.A 56.47,89.78 57.65,89.78 v58.24,90.37 | v59.72,101.59 60.61,100.7 61.79,100.7 R4.1 | v65.03,106.9 65.03,108.08 65.92,108.97 R9.2 | v60.61,119.6 61.49,120.48 62.67,120.48 R10.1 | v55.59,137.31 55.59,135.24 OK2.3 | v65.03,106.9 65.33,106.61 70.94,106.61 74.19,103.36 77.73,103.36 D4.A 78.32,103.06 84.82,96.57 93.38,96.57 96.04,93.91 96.04,90.66 96.33,90.37 | EMERGENCY.2 96.63,134.65 86.59,134.65 C18.1 86,134.65 82.75,134.65 C19.1 82.45,134.95 81.86,134.95 75.07,141.74 64.44,141.74 62.67,139.97 R6.1 62.67,139.38 65.03,137.02 65.63,137.02 66.81,135.84 66.81,129.63 | 66.81,129.63 65.63,128.45 R5.2 65.03,128.16 64.44,127.57 64.44,127.27 62.56,125.39 48.73,125.39 46.55,127.57 43.19,127.57 42.89,127.86 | R20.1 98.4,99.22 99.28,100.11 99.58,100.11 100.17,100.7 100.17,104.24 90.13,114.28 87.18,114.28 C10.1 86.59,114.58 83.34,114.58 C9.1 83.05,114.58 81.27,116.35 81.27,116.94 78.32,119.89 78.32,121.96 D2.A 77.73,122.55 75.37,124.91 71.53,124.91 66.81,129.63 | 44.37,105.42 43.19,106.61 COLLECTION.1 | 44.37,105.42 49.09,100.7 | 49.09,100.7 52.93,96.86 55.59,96.86 OK1.3 | 49.09,100.7 47.32,98.93 47.32,96.86 44.07,93.61 43.78,93.61 43.19,93.02 COLLECTION1.1 43.19,92.43 43.19,90.96 44.96,89.19 44.96,87.12 | 47.32,116.05 55.59,116.05 OK3.3 | 47.32,116.05 43.19,120.19 ARM2.1 42.6,120.48 40.82,122.25 40.82,125.8 42.89,127.86
  Bottom 1: 42.89,127.86 42.89,133.77 ARM1.1 | 47.32,108.38 44.37,105.42 | 47.32,116.05 47.32,108.38 | C5.1 85.41,60.55 82.75,60.55 C6.1 82.16,60.25 79.8,60.25 78.32,58.78 D5.A 78.62,58.48 80.09,57 80.09,50.21 | 80.09,50.21 80.09,44.31 78.32,42.54 78.32,35.45 D6.A | v59.43,54.64 61.49,54.64 62.08,54.05 62.67,54.05 R21.1 | v55.59,50.8 55.59,48.74 OK5.3 | v65.33,62.02 65.33,64.38 R13.2 | v65.92,43.72 65.92,40.76 R24.2 | 50.27,76.19 50.27,75.01 53.22,72.06 54.7,72.06 OK4.3 | 50.27,76.19 50.27,77.38 52.34,79.44 58.83,79.44 61.79,76.49 62.67,76.49 R14.1 | 44.07,78.56 43.19,78.56 WHEEL1.1 37.79,78.56 36.75,77.76 36.75,66.42 38.2,64.98 42.6,64.98 WHEEL2.1 42.89,64.38 42.89,60.25 41.12,58.48 41.12,52.57 42.89,50.8 WHEEL3.1 44.94,50.98 47.65,53.7 47.65,57 v48.95,58.3 | 44.07,78.56 46.43,76.19 50.27,76.19 | v74.48,50.21 80.09,50.21 | 44.96,87.12 44.96,79.44 44.07,78.56 | 47.32,108.38 48.5,107.2 64.74,107.2 v65.03,106.9 | 34.03,20.39 34.03,9.76 35.21,8.58 36.69,8.58 38.17,10.06 38.17,11.24 X10.2 38.46,11.83 38.46,18.03 42.89,22.46 COMMUNICATION.1 43.19,22.16 52.22,22.16 53.82,20.57 53.82,11.83 X10.8 | 34.03,20.39 34.03,21.57 42.89,30.43 42.89,36.63 WHEEL4.1 | 34.03,20.39 9.23,20.39 7.17,22.46 X3.1 | 44.96,87.12 44.66,87.12 43.78,86.23 13.37,86.23 6.87,92.73 X11.1
  pour Bottom: -0.16,146.95 -0.16,0.05 108.54,0.05 108.54,146.95
  pour Top: -0.16,146.95 108.64,146.95 108.64,0.05 -0.16,0.05
N$1
  Bottom 0.8: R3.1 64.44,85.05 57.95,85.05 56.47,83.58 51.16,83.58 50.57,84.17 50.57,88.89 55.59,93.91 OK1.4 56.18,94.21 57.65,95.68 57.65,97.16 55.59,99.22 55.59,100.11 R2.1
N$2
  Bottom 0.8: R13.1 62.38,64.68 62.38,67.04 60.9,68.52 60.9,70.29 62.38,71.77 OK4.2
N$3
  Bottom 0.8: R9.1 63.26,109.26 66.81,112.81 66.81,114.28 65.33,115.76 63.56,115.76 OK3.2
N$4
  Bottom 0.8: R8.1 52.93,128.75 52.93,129.93 55.29,132.29 OK2.4 55.88,132.59 57.36,134.06 57.36,137.9 55.88,139.38 55.59,139.38 R7.1
N$5
  Bottom 0.8: C2.1 69.17,139.67 65.63,139.67 R6.2
N$6
  Bottom 0.8: R12.1 53.22,109.26 53.22,111.03 55.59,113.4 OK3.4 55.88,113.69 57.65,115.46 57.65,116.64 55.88,118.42 55.88,120.19 R11.1
N$7
  Bottom 0.8: C4.1 69.46,76.49 65.92,76.49 R14.2
N$8
  Bottom 0.8: C3.1 69.46,120.78 65.63,120.78 R10.2
N$9
  Bottom 0.8: R15.2 52.34,76.49 53.82,77.97 58.24,77.97 62.38,73.83 65.03,73.83 69.76,69.11 69.76,68.22 71.53,66.45 72.42,66.45 Q4.G
N$10
  Bottom 0.8: R16.1 52.04,64.98 52.04,66.75 54.7,69.4 OK4.4 55,69.7 56.77,71.47 56.77,72.65 55.29,74.13 55.29,76.19 R15.1
N$11
  Bottom 0.8: C11.1 69.17,54.05 65.63,54.05 R21.2
N$12
  Bottom 0.8: R23.1 52.63,40.76 52.63,43.42 55.29,46.08 OK5.4 55.59,46.37 57.36,48.15 57.36,51.39 55.59,53.17 R22.1
N$13
  Bottom 0.8: R22.2 52.34,53.17 52.34,49.92 50.86,48.44 50.86,39.58 54.11,36.34 67.99,36.34 72.12,40.47 72.12,42.54 Q5.G
N$14
  Bottom 0.8: R5.1 61.75,128.45 58.99,131.2 58.99,135.26 59.49,135.72 62.55,135.72 OK2.2
N$15
  Bottom 0.8: R1.1 52.63,85.35 52.63,89.19 55.59,92.14 58.83,92.14 63.26,96.57 OK1.2
N$18
  Bottom 0.8: 6.87,97.75 X11.2
  Bottom 2: X12.2 6.88,97.73 6.87,97.75
N$19  (via drill 0.89)
  Top 0.8: v52.93,137.31 54.7,139.08 56.77,139.08 58.99,136.86 58.99,130.9 59.67,130.23 v68.87,130.23
  Bottom 0.8: v52.93,137.31 52.93,139.38 R7.2 | v68.87,130.23 71.53,130.23 71.83,129.93 Q2.G
N$21
  Bottom 0.8: R24.1 62.97,40.76 61.2,42.54 61.2,46.67 62.97,48.44 OK5.2
N$22
  Bottom 0.8: R11.2 52.93,120.48 54.7,122.25 56.77,122.25 58.83,120.19 58.83,119.01 60.02,117.82 65.63,117.82 69.46,113.99 69.46,112.51 71.24,110.74 72.12,110.74 Q3.G
N$29
  Bottom 2: CSW1.2 6.96,83.46 X2.2
N$32
  Bottom 0.8: 6.87,69.7 X4.2
  Bottom 2: CSW2.2 6.94,69.63 6.87,69.7
N$33
  Bottom 0.8: C1.1 69.17,100.7 65.03,100.7 R4.2
N$35  (via drill 0.89)
  Top 0.8: v63.26,87.71 69.17,87.71 v70.05,88.6
  Bottom 0.8: R2.2 52.93,100.41 53.82,101.29 53.82,101.59 55.59,103.36 72.12,103.36 74.97,100.51 74.97,98.85 79.01,94.81 79.06,94.81 79.06,94.8 79.07,94.8 79.58,94.28 83.74,90.13 84.94,88.93 84.94,85.35 84.24,84.65 78.8,84.65 78.78,84.66 78.12,84.66 72.12,90.66 Q1.G 71.83,90.37 v70.05,88.6 | v63.26,87.71 64.44,88.89 64.44,89.78 D1.C
N$36
  Bottom 0.8: CSW3.2 15.73,55.82 7.17,55.82 X6.2
N$40
  Bottom 2: CSW4.2 6.9,41.71 X8.2
N$51
  Bottom 0.8: 6.87,139.08 X17.2
  Bottom 2: CSA1.2 6.97,138.98 6.87,139.08
N$53
  Bottom 0.8: 6.87,125.5 X21.2
  Bottom 2: CSA2.2 7.05,125.32 6.87,125.5
N$57
  Bottom 0.8: 6.87,111.62 X25.2
  Bottom 2: X13.2 6.92,111.58 6.87,111.62
N$67
  Bottom 0.8: 7.17,27.77 X3.2
  Bottom 2: X5.2 7.4,27.53 7.17,27.77
VCC  (via drill 0.89)
  Top 0.7: v47.75,38.98 46.75,37.98 46.75,30.64 v47.85,29.54 | v42.2,73.96 42.35,74.11 38.92,77.54 v38.92,83.19 40.32,84.6 40.32,112.6 42.85,115.13 v42.85,115.79 46.35,119.29 46.35,125.01 v46.05,125.31 | v30.69,65.25 35.29,60.65 v35.29,34.8
  Bottom 0.7: X10.1 36.1,11.83 36.1,20.69 42.89,27.48 COMMUNICATION.3 45.9,27.59 v47.85,29.54 | v47.75,38.98 44.85,41.89 WHEEL4.3 42.6,41.95 41.13,41.95 35.29,36.1 v35.29,34.8 | WHEEL3.3 43.19,56.12 43.19,58.78 44.66,60.25 44.66,68.22 43.19,69.7 WHEEL2.3 42.89,69.99 42.6,70.28 42.6,73.96 v42.2,73.96 | WHEEL1.3 42.89,83.58 42,83.58 41.62,83.19 v38.92,83.19 38.62,82.9 32.91,82.9 29.5,79.49 29.5,66.43 v30.69,65.25 | COLLECTION1.3 42.89,98.04 42.89,104.24 41.12,106.01 41.12,109.85 42.89,111.62 COLLECTION.3 43.1,115.54 v42.85,115.79 43.3,116.23 39.35,120.19 39.35,135.24 42.89,138.79 ARM1.3 | v46.05,125.31 42.99,125.31 ARM2.3

### Text on the board
tPlace: Voltage Sensor | POWER DISTRIBUTION & / SAFETY SYSTEM BOARD
bValues: 0.1nF | 0.1nF